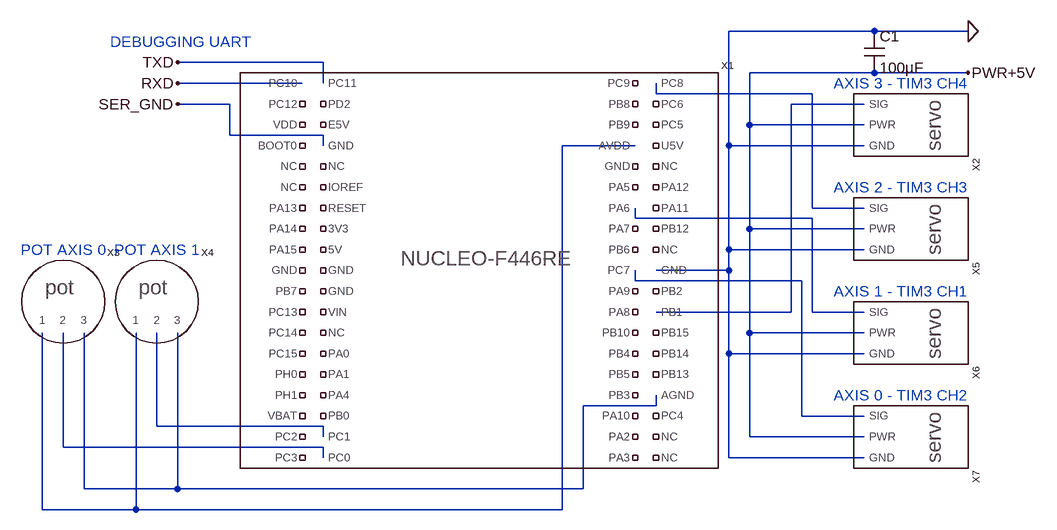
[diagram p0: schematic scara_controller.asc]
scara_controller.asc, the LTspice schematic file:
Version 4
SHEET 1 1096 680
WIRE 800 -272 576 -272
WIRE 944 -272 800 -272
WIRE -48 -224 -272 -224
WIRE 800 -208 608 -208
WIRE 944 -208 800 -208
WIRE -80 -192 -272 -192
WIRE -48 -192 -48 -224
WIRE 464 -176 464 -192
WIRE 704 -176 464 -176
WIRE -192 -160 -272 -160
WIRE 784 -160 672 -160
WIRE 608 -128 608 -208
WIRE 784 -128 608 -128
WIRE -192 -112 -192 -160
WIRE -48 -112 -192 -112
WIRE -48 -96 -48 -112
WIRE 432 -96 320 -96
WIRE 576 -96 576 -272
WIRE 784 -96 576 -96
WIRE 704 0 704 -176
WIRE 784 0 704 0
WIRE 432 16 432 0
WIRE 704 16 432 16
WIRE 608 32 608 -128
WIRE 784 32 608 32
WIRE 576 64 576 -96
WIRE 784 64 576 64
WIRE 576 96 576 64
WIRE 576 96 464 96
WIRE 432 112 432 96
WIRE 688 112 432 112
WIRE 672 160 672 -160
WIRE 672 160 464 160
WIRE 704 160 704 16
WIRE 784 160 704 160
WIRE 608 192 608 32
WIRE 784 192 608 192
WIRE 576 224 576 96
WIRE 784 224 576 224
WIRE 464 304 464 288
WIRE 464 304 352 304
WIRE 688 320 688 112
WIRE 784 320 688 320
WIRE -304 336 -304 192
WIRE -48 336 -304 336
WIRE -48 352 -48 336
WIRE 608 352 608 192
WIRE 784 352 608 352
WIRE -448 368 -448 192
WIRE -48 368 -448 368
WIRE -48 384 -48 368
WIRE 576 384 576 224
WIRE 784 384 576 384
WIRE -416 432 -416 192
WIRE -272 432 -272 192
WIRE -272 432 -416 432
WIRE 352 432 352 304
WIRE 352 432 -272 432
WIRE -480 464 -480 192
WIRE -336 464 -336 192
WIRE -336 464 -480 464
WIRE 320 464 320 -96
WIRE 320 464 -336 464
FLAG 944 -208 PWR+5V
FLAG 944 -272 0
FLAG -272 -224 TXD
FLAG -272 -192 RXD
FLAG -272 -160 SER_GND
SYMBOL nucleo-f446re -32 -128 R0
SYMATTR InstName X1
SYMBOL pot -448 144 R0
SYMATTR InstName X3
SYMBOL pot -304 144 R0
SYMATTR InstName X4
SYMBOL servo 800 -128 R90
SYMATTR InstName X2
SYMBOL servo 800 32 R90
SYMATTR InstName X5
SYMBOL servo 800 192 R90
SYMATTR InstName X6
SYMBOL servo 800 352 R90
SYMATTR InstName X7
SYMBOL cap 784 -272 R0
SYMATTR InstName C1
SYMATTR Value 100µF
TEXT 944 288 Right 2 ;AXIS 0 - TIM3 CH2
TEXT 944 128 Right 2 ;AXIS 1 - TIM3 CH1
TEXT 944 -32 Right 2 ;AXIS 2 - TIM3 CH3
TEXT 944 -192 Right 2 ;AXIS 3 - TIM3 CH4
TEXT -304 64 Center 2 ;POT AXIS 1
TEXT -448 64 Center 2 ;POT AXIS 0
TEXT -376 -256 Left 2 ;DEBUGGING UART

The netlist it stands for:
* scara_controller.asc
XX1 RXD NC_01 NC_02 NC_03 NC_04 NC_05 NC_06 NC_07 NC_08 NC_09 NC_10 NC_11 NC_12 NC_13 NC_14 NC_15 NC_16 NC_17 NC_18 TXD NC_19 NC_20 SER_GND NC_21 NC_22 NC_23 NC_24 NC_25 NC_26 NC_27 NC_28 NC_29 NC_30 NC_31 NC_32 NC_33 N007 N008 NC_34 NC_35 NC_36 N003 NC_37 NC_38 N004 NC_39 NC_40 N005 NC_41 NC_42 NC_43 NC_44 NC_45 NC_46 NC_47 NC_48 NC_49 N001 NC_50 NC_51 NC_52 NC_53 NC_54 NC_55 NC_56 NC_57 0 NC_58 N002 NC_59 NC_60 NC_61 N006 NC_62 NC_63 NC_64 nucleo-f446re  ; pins PC10 PC12 VDD BOOT0 NC NC PA13 PA14 PA15 GND PB7 PC13 PC14 PC15 PH0 PH1 VBAT PC2 PC3 PC11 PD2 E5V GND NC IOREF RESET 3V3 5V GND GND VIN NC PA0 PA1 PA4 PB0 PC1 PC0 PC9 PB8 PB9 AVDD GND PA5 PA6 PA7 PB6 PC7 PA9 PA8 PB10 PB4 PB5 PB3 PA10 PA2 PA3 PC8 PC6 PC5 U5V NC PA12 PA11 PB12 NC GND PB2 PB1 PB15 PB14 PB13 AGND PC4 NC NC
XX3 N003 N008 N006 pot  ; pins 1 2 3
XX4 N003 N007 N006 pot  ; pins 1 2 3
XX2 N002 PWR+5V 0 servo  ; pins SIG PWR GND
XX5 N001 PWR+5V 0 servo  ; pins SIG PWR GND
XX6 N004 PWR+5V 0 servo  ; pins SIG PWR GND
XX7 N005 PWR+5V 0 servo  ; pins SIG PWR GND
C1 0 PWR+5V 100µF
* AXIS 0 - TIM3 CH2
* AXIS 1 - TIM3 CH1
* AXIS 2 - TIM3 CH3
* AXIS 3 - TIM3 CH4
* POT AXIS 1
* POT AXIS 0
* DEBUGGING UART
.backanno
.end